# Altium schematic sheet MCU.SchDoc
size A3; SheetNumber: 2; SheetTotal: 14
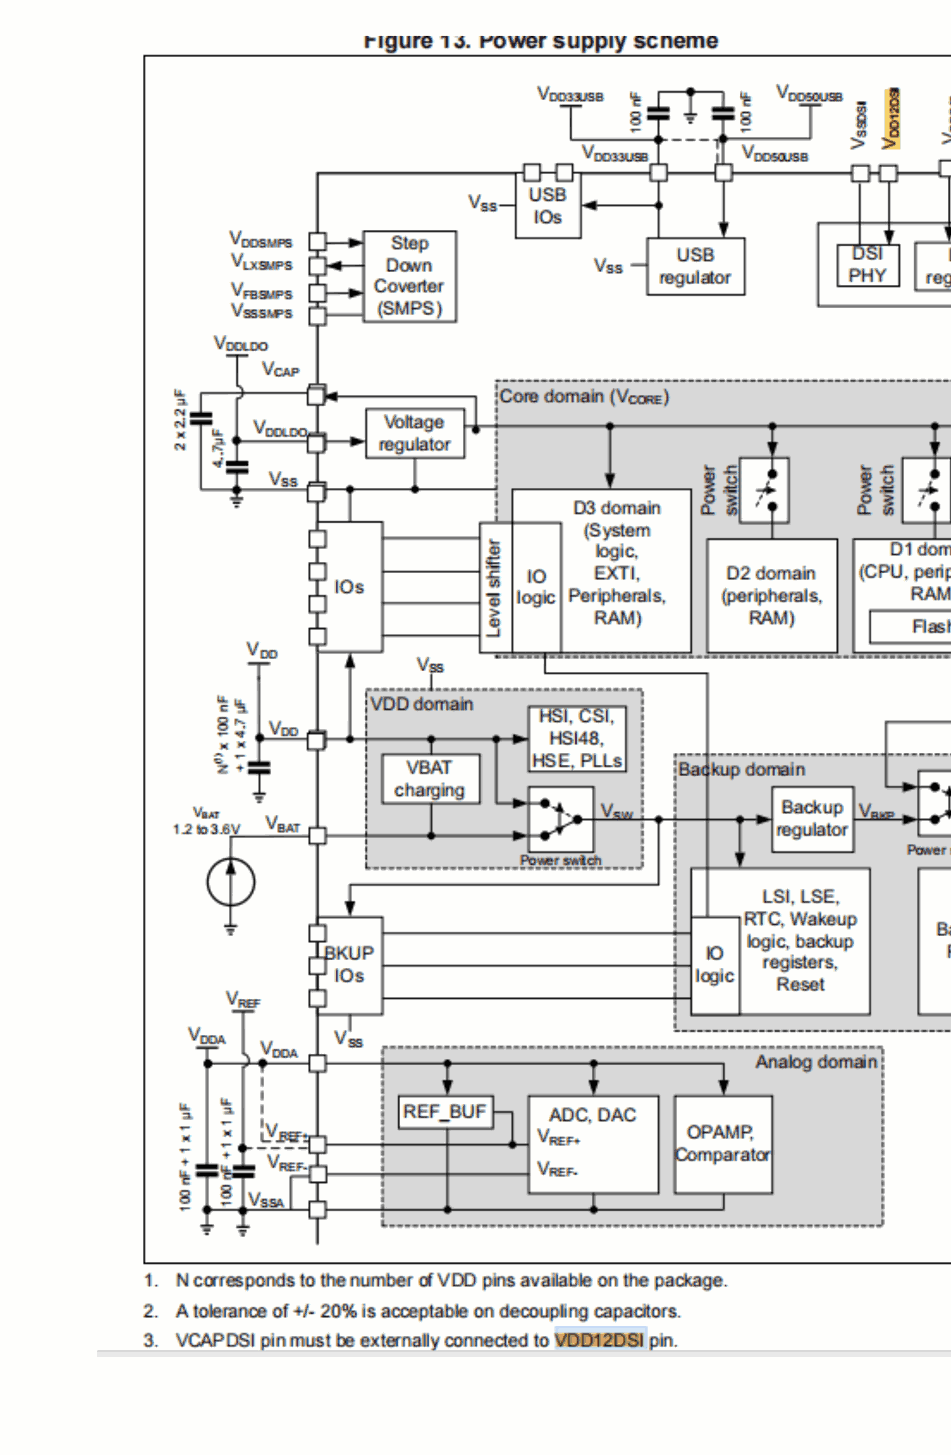
[diagram p0: MCU.SchDoc, top left]
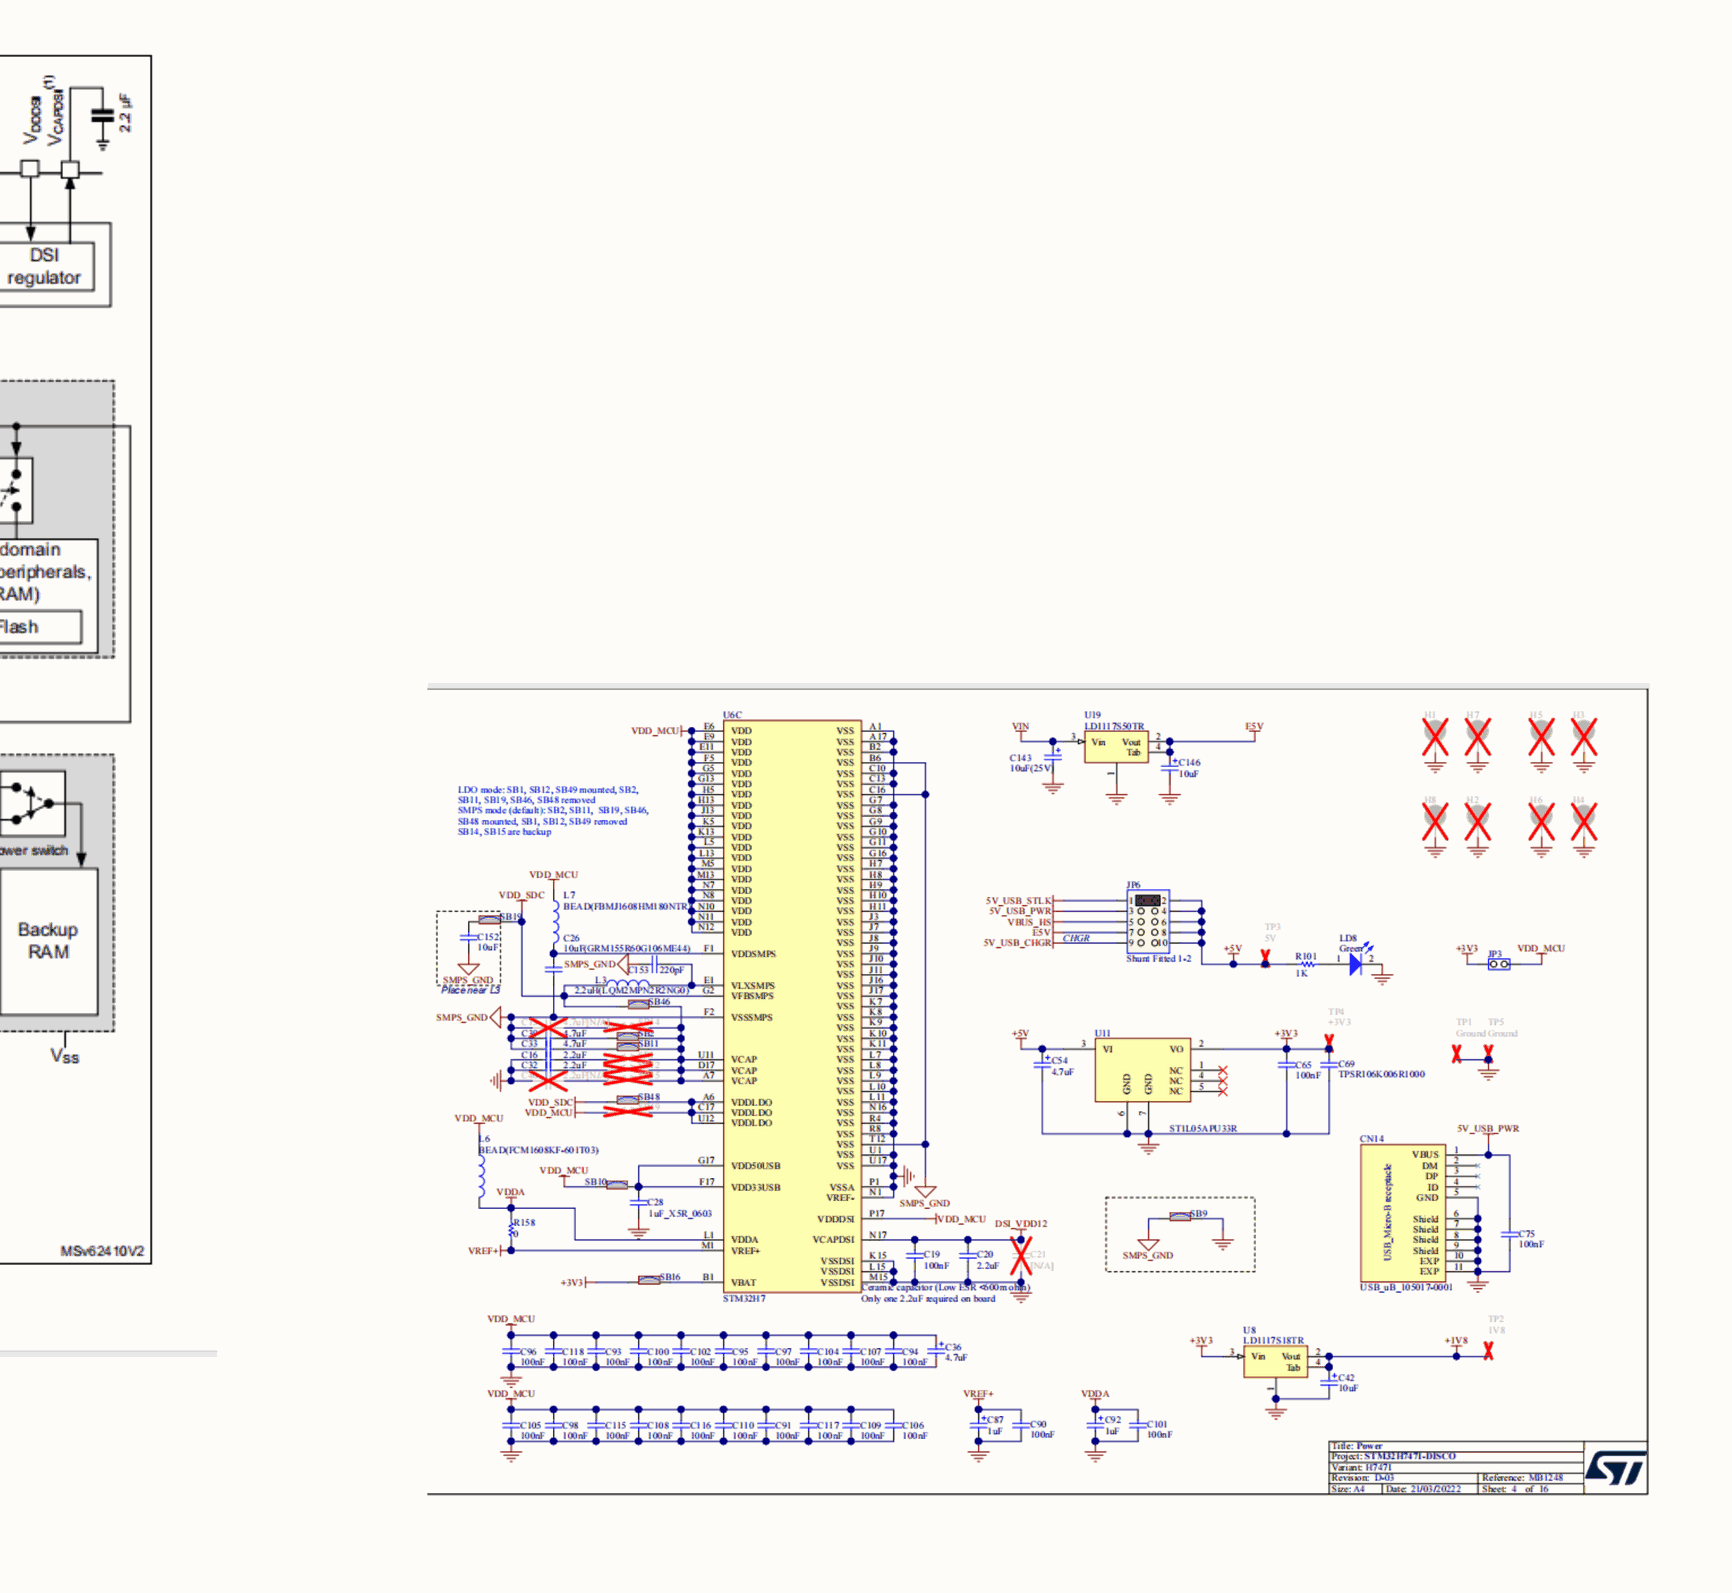
[diagram p1: MCU.SchDoc, top middle]
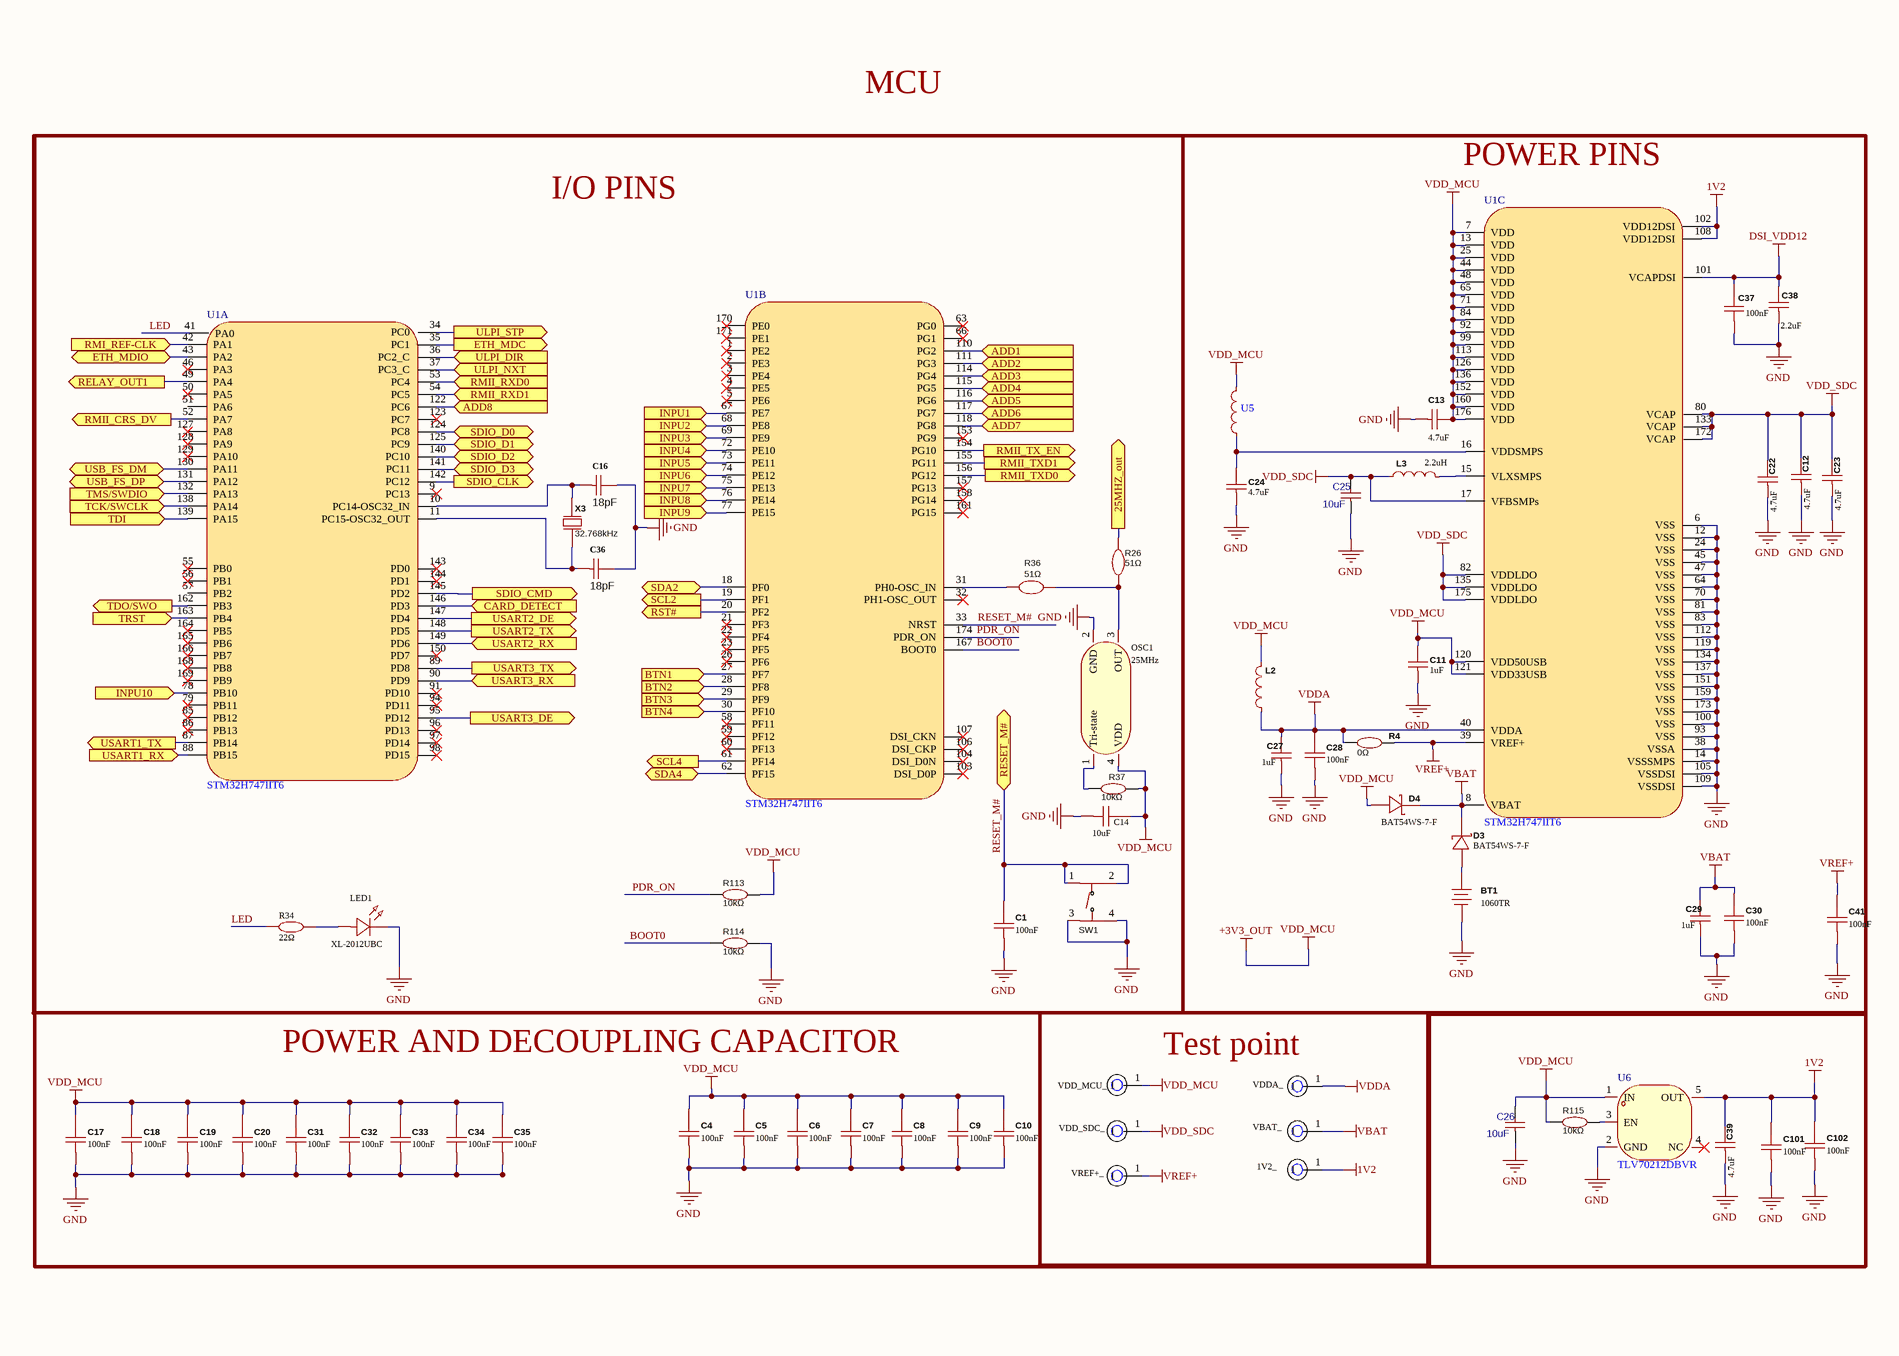
[diagram p2: MCU.SchDoc, bottom left]
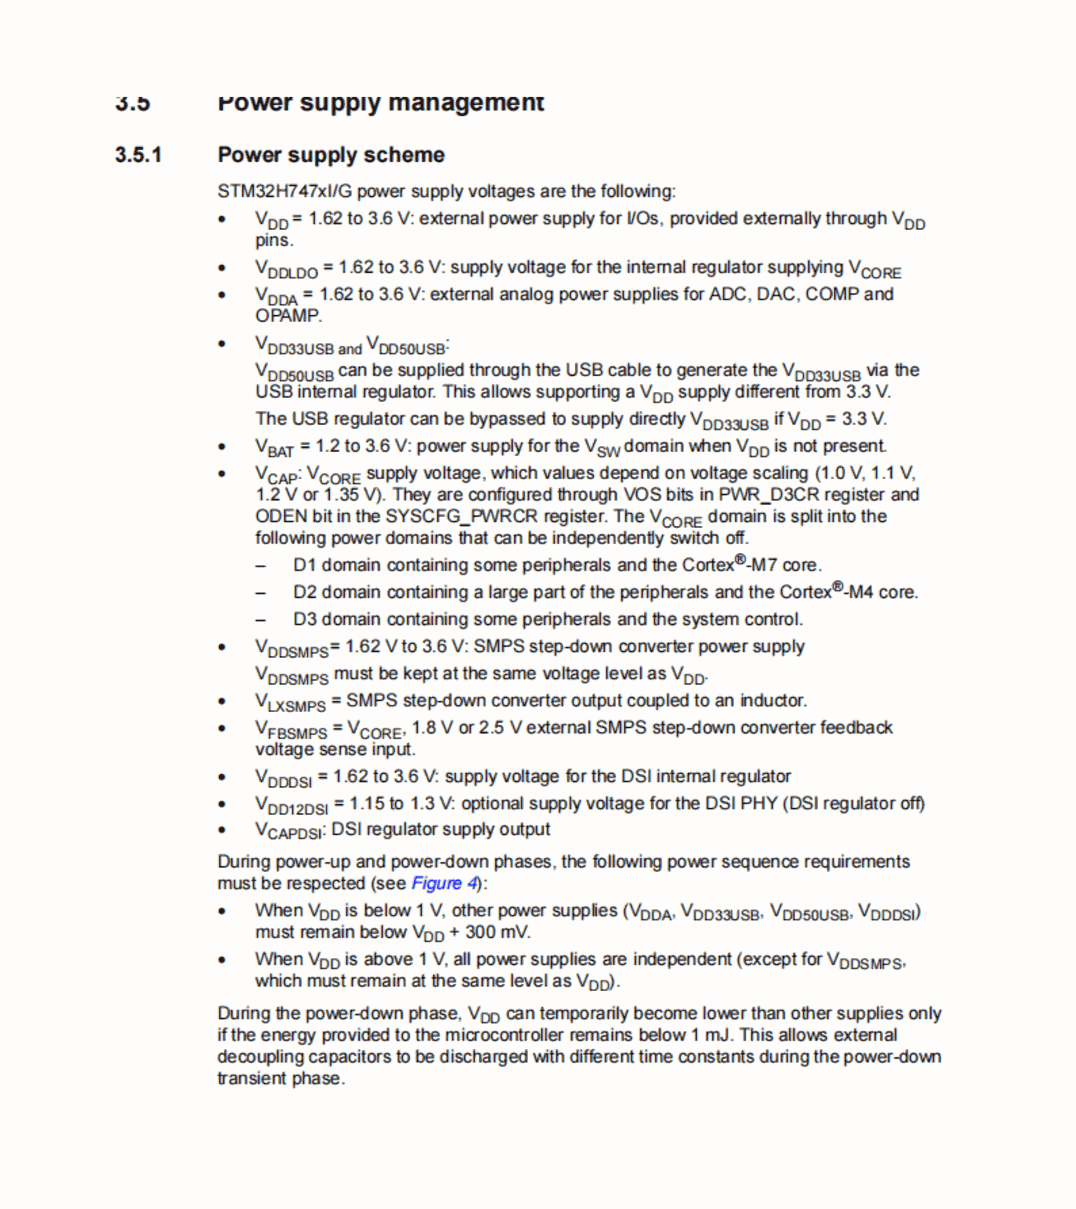
[diagram p3: MCU.SchDoc, bottom middle]
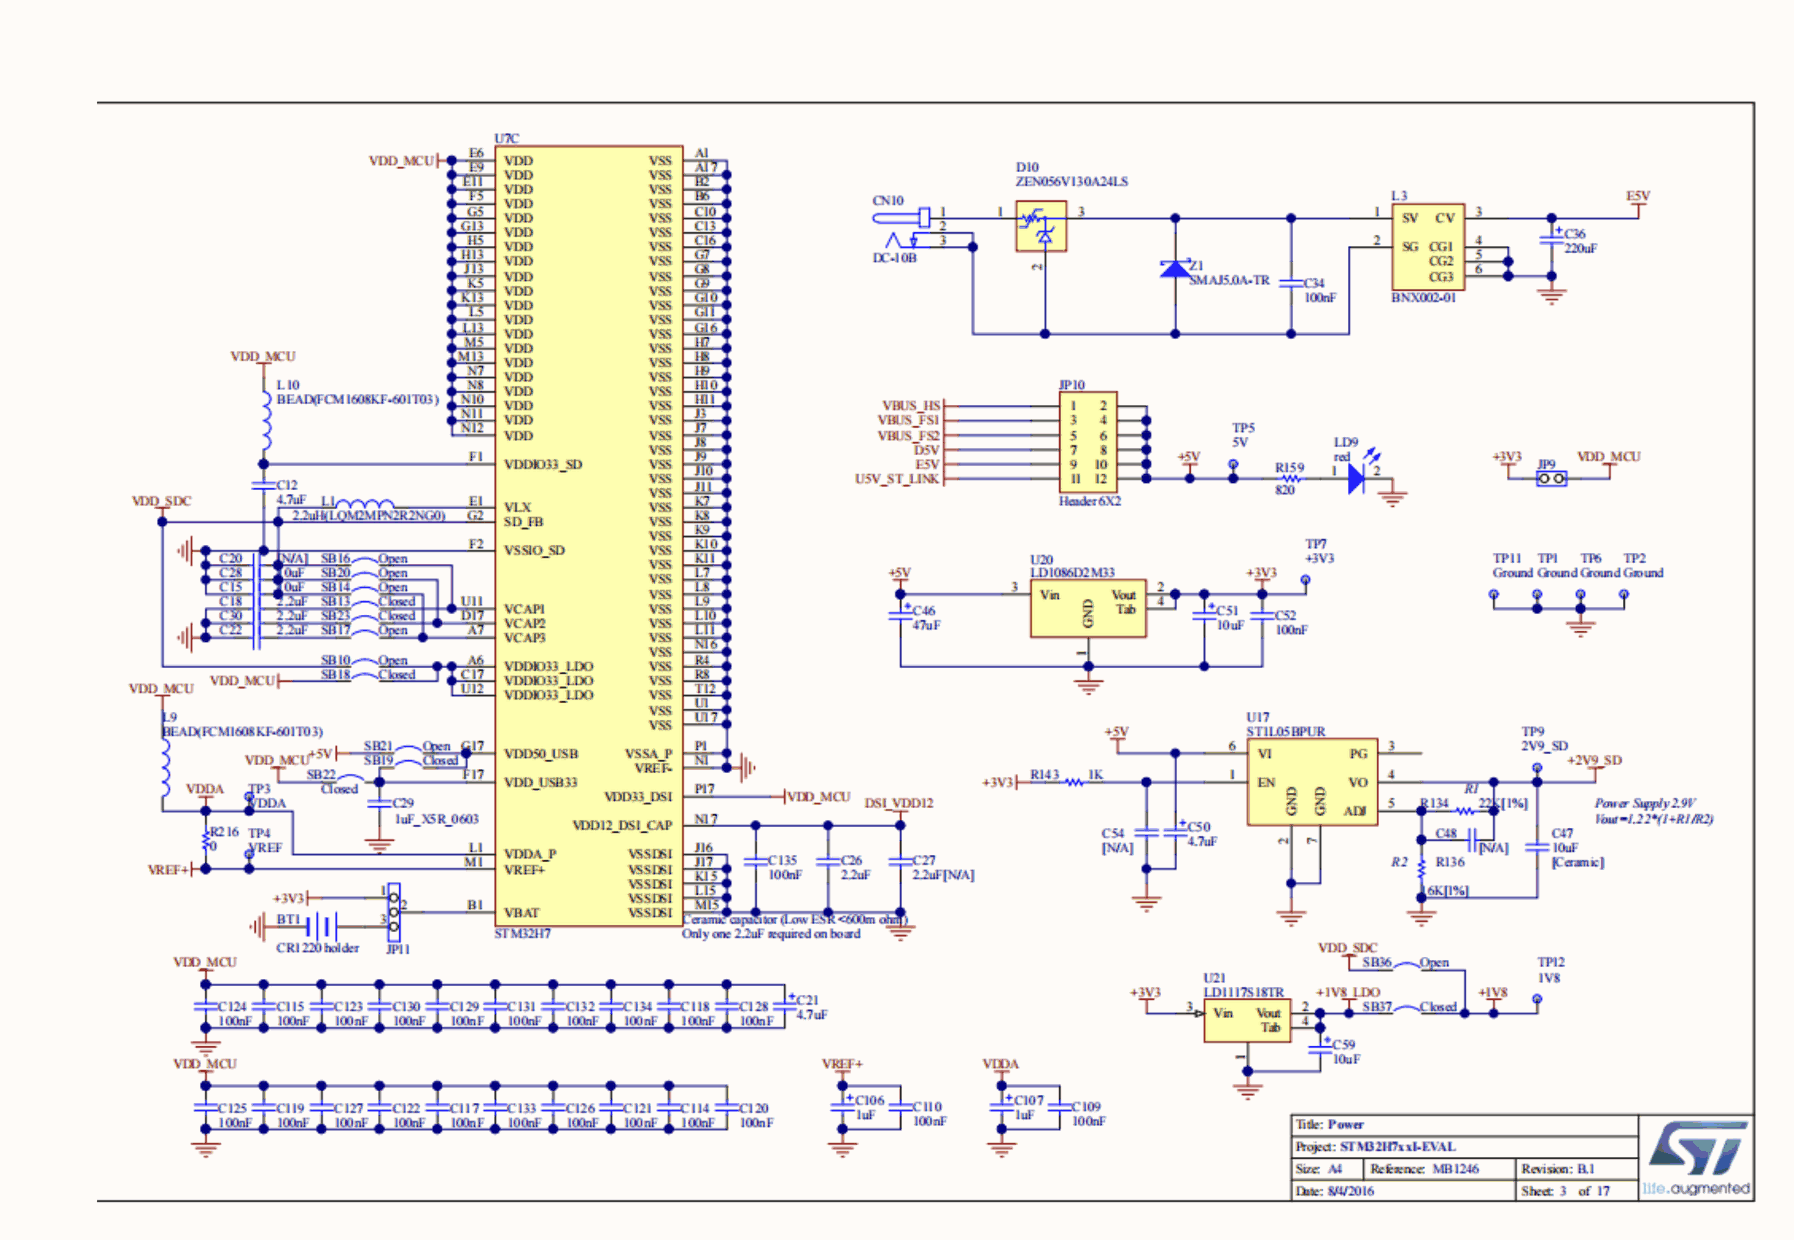
[diagram p4: MCU.SchDoc, bottom right]

## Parts
1V2_  TP  [TP]  (value not drawn)  (no BOM)
BT1  1060TR  [BAT-SMD_1060TR]
C1  100nF  [C_0603]
C4  100nF  [C_0603]
C5  100nF  [C_0603]
C6  100nF  [C_0603]
C7  100nF  [C_0603]
C8  100nF  [C_0603]
C9  100nF  [C_0603]
C10  100nF  [C_0603]
C11  1uF  [C_0805]
C12  4.7uF  [C_0805]
C13  4.7uF  [C_0805]
C14  10uF  [C_0603]
C16  18pF  [C_0603]
C17  100nF  [C_0603]
C18  100nF  [C_0603]
C19  100nF  [C_0603]
C20  100nF  [C_0603]
C22  4.7uF  [C_0805]
C23  4.7uF  [C_0805]
C24  4.7uF  [C_0805]
C25  10uF  [C_0805]
C26  10uF  [C_0805]
C27  1uF  [C_0805]
C28  100nF  [C_0603]
C29  1uF  [C_0805]
C30  100nF  [C_0603]
C31  100nF  [C_0603]
C32  100nF  [C_0603]
C33  100nF  [C_0603]
C34  100nF  [C_0603]
C35  100nF  [C_0603]
C36  18pF  [C_0603]
C37  100nF  [C_0603]
C38  2.2uF  [C_0805]
C39  4.7uF  [C_0805]
C41  100nF  [C_0603]
C101  100nF  [C_0603]
C102  100nF  [C_0603]
D3  BAT54WS-7-F  [SOD-323_L1.8-W1.3-LS2.5-RD]
D4  BAT54WS-7-F  [SOD-323_L1.8-W1.3-LS2.5-RD]
L2  FCM1608KF-601T03  [R_0603]  (value not drawn)
L3  2.2uH  [l0806]
LED1  XL-2012UBC  [LED0805-RD]
OSC1  25MHz  [OSC-SMD_4P-L2.5-W2.0-BL]
R4  0Ω  [R_0402]  (no BOM)
R26  51Ω  [R_0603]
R34  22Ω  [R_0603]
R36  51Ω  [R_0603]
R37  10kΩ  [R_0603]
R113  10kΩ  [R_0603]
R114  10kΩ  [R_0603]
R115  10kΩ  [R_0603]
SW1  TS-1187A-B-A-B  [SW-SMD_4P-L5.1-W5.1-P3.70-LS6.5-TL_H1.5]  (value not drawn)
U1  STM32H747IIT6  [LQFP-176_L24.0-W24.0-P0.50-LS26.0-BL]  (parts A,B,C of 3)
U5  ferrite_bead  [L_0603]  (value not drawn)
U6  TLV70212DBVR  [SOT-23-5_L3.0-W1.7-P0.95-LS2.8-BL]
VBAT_  TP  [TP]  (value not drawn)  (no BOM)
VDD_MCU_  TP  [TP]  (value not drawn)  (no BOM)
VDD_SDC_  TP  [TP]  (value not drawn)  (no BOM)
VDDA_  TP  [TP]  (value not drawn)  (no BOM)
VREF+_  TP  [TP]  (value not drawn)  (no BOM)
X3  32.768kHz  [OSC-SMD_2P-L3.2-W1.5]

## Blocks framed on the sheet
POWER PINS: BT1 C11-C13 C22-C25 C27-C30 C37 C38 C41 D3 D4 L2 L3 R4 U1 U5
I/O PINS: C1 C14 C16 C36 LED1 OSC1 R26 R34 R36 R37 R113 R114 SW1 U1 X3
POWER AND DECOUPLING CAPACITOR: C4-C10 C17-C20 C26 C31-C35 C39 C101 C102 R115 U6
Test point: 1V2_ VBAT_ VDD_MCU_ VDD_SDC_ VDDA_ VREF+_

## Ports
25MHZ_out (out), ADD1 (in), ADD2 (in), ADD3 (in), ADD4 (in), ADD5 (in), ADD6 (in), ADD7 (in), ADD8 (in), BTN1 (in), BTN2 (in), BTN3 (in), BTN4 (in), CARD_DETECT (in), ETH_MDC (out), ETH_MDIO (bidir), INPU1 (in), INPU2 (in), INPU3 (in), INPU4 (in), INPU5 (in), INPU6 (in), INPU7 (in), INPU8 (in), INPU9 (in), INPU10 (in), RELAY_OUT1 (out), RESET_M# (bidir), RMI_REF-CLK (in), RMII_CRS_DV (out), RMII_RXD0 (in), RMII_RXD1 (in), RMII_TX_EN (out), RMII_TXD0 (out), RMII_TXD1 (out), RST# (out), SCL2 (out), SCL4 (out), SDA2 (bidir), SDA4 (bidir), SDIO_CLK (out), SDIO_CMD (out), SDIO_D0 (bidir), SDIO_D1 (bidir), SDIO_D2 (bidir), SDIO_D3 (bidir), TCK/SWCLK (in), TDI (in), TDO/SWO (out), TMS/SWDIO (in), TRST (in), ULPI_DIR (in), ULPI_NXT (in), ULPI_STP (out), USART1_RX (in), USART1_TX (out), USART2_DE (out), USART2_RX (in), USART2_TX (out), USART3_DE (out), USART3_RX (in), USART3_TX (out), USB_FS_DM (bidir), USB_FS_DP (bidir)

## Nets
1V2: 1V2_.1 C39.2 C101.1 C102.1 U1.102(VDD12DSI) U1.108(VDD12DSI) U6.5(OUT)
+3V3_OUT: C4.1 C5.1 C6.1 C7.1 C8.1 C9.1 C10.1 C11.2 C13.2 C14.1 C17.1 C18.1 C19.1 C20.1 C26.2 C31.1 C32.1 C33.1 C34.1 C35.1 D4.2 L2.2 OSC1.4(VDD) R37.1 R113.1 R115.1 U1.7(VDD) U1.13(VDD) U1.25(VDD) U1.44(VDD) U1.48(VDD) U1.65(VDD) U1.71(VDD) U1.84(VDD) U1.92(VDD) U1.99(VDD) U1.113(VDD) U1.120(VDD50USB) U1.121(VDD33USB) U1.126(VDD) U1.136(VDD) U1.152(VDD) U1.160(VDD) U1.176(VDD) U5.2 U6.1(IN) VDD_MCU_.1  [also labelled VDD_MCU]
DSI_VDD12: C37.1 C38.2 U1.101(VCAPDSI)
GND: BT1.2(-) C1.2 C4.2 C5.2 C6.2 C7.2 C8.2 C9.2 C10.2 C11.1 C12.1 C13.1 C14.2 C16.2 C17.2 C18.2 C19.2 C20.2 C22.1 C23.1 C24.1 C25.1 C26.1 C27.1 C28.2 C29.1 C30.2 C31.2 C32.2 C33.2 C34.2 C35.2 C36.2 C37.2 C38.1 C39.1 C41.2 C101.2 C102.2 LED1.1(K) OSC1.2(GND) R114.1 SW1.3(C) SW1.4(D) U1.6(VSS) U1.12(VSS) U1.14(VSSSMPS) U1.24(VSS) U1.38(VSSA) U1.45(VSS) U1.47(VSS) U1.64(VSS) U1.70(VSS) U1.81(VSS) U1.83(VSS) U1.93(VSS) U1.100(VSS) U1.105(VSSDSI) U1.109(VSSDSI) U1.112(VSS) U1.119(VSS) U1.134(VSS) U1.137(VSS) U1.151(VSS) U1.159(VSS) U1.173(VSS) U6.2(GND)
VBAT: C29.2 C30.1 D3.1 D4.1 U1.8(VBAT) VBAT_.1
VDD_SDC: C12.2 C22.2 C23.2 C25.2 L3.1 U1.17(VFBSMPs) U1.80(VCAP) U1.82(VDDLDO) U1.133(VCAP) U1.135(VDDLDO) U1.172(VCAP) U1.175(VDDLDO) VDD_SDC_.1
VDDA: C27.2 C28.1 L2.1 R4.2 U1.40(VDDA) VDDA_.1
VREF+: C41.1 R4.1 U1.39(VREF+) VREF+_.1
25MHZ_out: R26.2 ; port 25MHZ_out
ADD1: U1.110(PG2) ; port ADD1
ADD2: U1.111(PG3) ; port ADD2
ADD3: U1.114(PG4) ; port ADD3
ADD4: U1.115(PG5) ; port ADD4
ADD5: U1.116(PG6) ; port ADD5
ADD6: U1.117(PG7) ; port ADD6
ADD7: U1.118(PG8) ; port ADD7
ADD8: U1.122(PC6) ; port ADD8
BOOT0: R114.2 U1.167(BOOT0)
BTN1: U1.27(PF7) ; port BTN1
BTN2: U1.28(PF8) ; port BTN2
BTN3: U1.29(PF9) ; port BTN3
BTN4: U1.30(PF10) ; port BTN4
CARD_DETECT: U1.146(PD3) ; port CARD_DETECT
ETH_MDC: U1.35(PC1) ; port ETH_MDC
ETH_MDIO: U1.43(PA2) ; port ETH_MDIO
INPU1: U1.67(PE7) ; port INPU1
INPU2: U1.68(PE8) ; port INPU2
INPU3: U1.69(PE9) ; port INPU3
INPU4: U1.72(PE10) ; port INPU4
INPU5: U1.73(PE11) ; port INPU5
INPU6: U1.74(PE12) ; port INPU6
INPU7: U1.75(PE13) ; port INPU7
INPU8: U1.76(PE14) ; port INPU8
INPU9: U1.77(PE15) ; port INPU9
INPU10: U1.78(PB10) ; port INPU10
LED: R34.2 U1.41(PA0)
PDR_ON: R113.2 U1.174(PDR_ON)
RELAY_OUT1: U1.49(PA4) ; port RELAY_OUT1
RESET_M#: C1.1 SW1.1(A) SW1.2(B) U1.33(NRST) ; port RESET_M#
RMI_REF-CLK: U1.42(PA1) ; port RMI_REF-CLK
RMII_CRS_DV: U1.52(PA7) ; port RMII_CRS_DV
RMII_RXD0: U1.53(PC4) ; port RMII_RXD0
RMII_RXD1: U1.54(PC5) ; port RMII_RXD1
RMII_TX_EN: U1.154(PG10) ; port RMII_TX_EN
RMII_TXD0: U1.156(PG12) ; port RMII_TXD0
RMII_TXD1: U1.155(PG11) ; port RMII_TXD1
RST#: U1.20(PF2) ; port RST#
SCL2: U1.19(PF1) ; port SCL2
SCL4: U1.61(PF14) ; port SCL4
SDA2: U1.18(PF0) ; port SDA2
SDA4: U1.62(PF15) ; port SDA4
SDIO_CLK: U1.142(PC12) ; port SDIO_CLK
SDIO_CMD: U1.145(PD2) ; port SDIO_CMD
SDIO_D0: U1.124(PC8) ; port SDIO_D0
SDIO_D1: U1.125(PC9) ; port SDIO_D1
SDIO_D2: U1.140(PC10) ; port SDIO_D2
SDIO_D3: U1.141(PC11) ; port SDIO_D3
TCK/SWCLK: U1.138(PA14) ; port TCK/SWCLK
TDI: U1.139(PA15) ; port TDI
TDO/SWO: U1.162(PB3) ; port TDO/SWO
TMS/SWDIO: U1.132(PA13) ; port TMS/SWDIO
TRST: U1.163(PB4) ; port TRST
ULPI_DIR: U1.36(PC2_C) ; port ULPI_DIR
ULPI_NXT: U1.37(PC3_C) ; port ULPI_NXT
ULPI_STP: U1.34(PC0) ; port ULPI_STP
USART1_RX: U1.88(PB15) ; port USART1_RX
USART1_TX: U1.87(PB14) ; port USART1_TX
USART2_DE: U1.147(PD4) ; port USART2_DE
USART2_RX: U1.149(PD6) ; port USART2_RX
USART2_TX: U1.148(PD5) ; port USART2_TX
USART3_DE: U1.95(PD12) ; port USART3_DE
USART3_RX: U1.90(PD9) ; port USART3_RX
USART3_TX: U1.89(PD8) ; port USART3_TX
USB_FS_DM: U1.130(PA11) ; port USB_FS_DM
USB_FS_DP: U1.131(PA12) ; port USB_FS_DP
NetBT1_1: BT1.1(+) D3.2
NetC16_1: C16.1 U1.10(PC14-OSC32_IN) X3.1(OSC1)
NetC24_2: C24.2 U1.16(VDDSMPS) U5.1
NetC36_1: C36.1 U1.11(PC15-OSC32_OUT) X3.2(OSC2)
NetL3_2: L3.2 U1.15(VLXSMPS)
NetLED1_2: LED1.2(A) R34.1
NetOSC1_1: OSC1.1(Tri-state) R37.2
NetOSC1_3: OSC1.3(OUT) R26.1 R36.2
NetR36_1: R36.1 U1.31(PH0-OSC_IN)
NetR115_2: R115.2 U6.3(EN)

Not connected (* = marked no-connect by the designer): U1 1(PE2)* 2(PE3)* 3(PE4)* 4(PE5)* 5(PE6)* 9(PC13)* 21(PF3)* 22(PF4)* 23(PF5)* 26(PF6)* 32(PH1-OSC_OUT)* 46(PA3)* 50(PA5)* 51(PA6) 55(PB0)* 56(PB1)* 57(PB2) 58(PF11)* 59(PF12)* 60(PF13)* 63(PG0)* 66(PG1)* 79(PB11)* 85(PB12)* 86(PB13)* 91(PD10)* 94(PD11)* 96(PD13)* 97(PD14)* 98(PD15)* 103(DSI_D0P)* 104(DSI_D0N)* 106(DSI_CKP)* 107(DSI_CKN)* 123(PC7)* 127(PA8)* 128(PA9)* 129(PA10)* 143(PD0)* 144(PD1)* 150(PD7)* 153(PG9)* 157(PG13)* 158(PG14)* 161(PG15)* 164(PB5)* 165(PB6)* 166(PB7)* 168(PB8)* 169(PB9)* 170(PE0)* 171(PE1)*; U6 4(NC)*

## Notes on the sheet
- MCU
- Project Name:
- Size:
- Date:
- A3
- Version:
- Time:
- V1.4.0.0
- Sheet:
- Of
- File:

## Library data of the parts
BT1 = 1060TR: Manufacturer: Keystone; Add into BOM: yes; Symbol: 1060TR; Device: 1060TR; LCSC Part Name: 1060TR; Supplier Part: C238069; Manufacturer Part: 1060TR; Supplier Footprint: SMD; JLCPCB Part Class: Extended Part; Datasheet: https://atta.szlcsc.com/upload/public/pdf/source/20230320/C1BE6CFA374F9ACD78161F1E1BA128C8.pdf; Supplier: LCSC; Convert to PCB: yes
C1 C4-C10 C17-C20 C28 C30-C35 C37 C41 C101 C102 = CC0603KRX7R9BB104: Manufacturer: YAGEO(国巨); Add into BOM: yes; Tolerance: ±10%; Voltage Rating: 50V; Temperature Coefficient: X7R; Symbol: CC0603KRX7R9BB104; Device: CC0603KRX7R9BB104; LCSC Part Name: 100nF ±10% 50V; Supplier Part: C14663; Manufacturer Part: CC0603KRX7R9BB104; Supplier Footprint: 0603; JLCPCB Part Class: Basic Part; Datasheet: https://item.szlcsc.com/datasheet/CC0603KRX7R9BB104/15331.html; Supplier: LCSC; Convert to PCB: yes; Value: 100nF
C11 C27 C29 = CL21B105KBFNNNE: Manufacturer: SAMSUNG(三星); Add into BOM: yes; Tolerance: ±10%; Voltage Rating: 50V; Temperature Coefficient: X7R; Symbol: CL21B105KBFNNNE; Device: CL21B105KBFNNNE; Supplier: LCSC; Manufacturer Part: CL21B105KBFNNNE; Value: 1uF; Supplier Part: C28323; JLCPCB Part Class: Basic Part; LCSC Part Name: 1uF ±10% 50V; Supplier Footprint: 0805; Datasheet: https://item.szlcsc.com/datasheet/CL21B105KBFNNNE/29074.html; Convert to PCB: yes
C12 C13 C22-C24 C39 = CL21A475KBQNNNE: Manufacturer: SAMSUNG(三星); Add into BOM: yes; Tolerance: ±10%; Voltage Rating: 50V; Temperature Coefficient: X5R; Symbol: CL21A475KBQNNNE; Device: CL21A475KBQNNNE; LCSC Part Name: 4.7uF ±10% 50V; Supplier Part: C98192; Manufacturer Part: CL21A475KBQNNNE; Supplier Footprint: 0805; JLCPCB Part Class: Extended Part; Datasheet: https://item.szlcsc.com/datasheet/CL21A475KBQNNNE/99401.html; Supplier: LCSC; Convert to PCB: yes; Value: 4.7uF
C14 = CL10A106KP8NNNC: Manufacturer: SAMSUNG(三星); Add into BOM: yes; Tolerance: ±10%; Voltage Rating: 10V; Temperature Coefficient: X5R; Symbol: CL10A106KP8NNNC; Device: CL10A106KP8NNNC; LCSC Part Name: 10uF ±10% 10V; Supplier Part: C19702; Manufacturer Part: CL10A106KP8NNNC; Supplier Footprint: 0603; JLCPCB Part Class: Basic Part; Datasheet: https://item.szlcsc.com/datasheet/CL10A106KP8NNNC/20411.html; Supplier: LCSC; Convert to PCB: yes; Value: 10uF
C16 C36 = CL10C180JB8NNNC: Manufacturer: SAMSUNG(三星); Add into BOM: yes; Tolerance: ±5%; Voltage Rating: 50V; Temperature Coefficient: C0G; Symbol: CL10C180JB8NNNC; Device: CL10C180JB8NNNC; LCSC Part Name: 18pF ±5% 50V; Supplier Part: C1647; Manufacturer Part: CL10C180JB8NNNC; Supplier Footprint: 0603; JLCPCB Part Class: Basic Part; Datasheet: https://item.szlcsc.com/datasheet/CL10C180JB8NNNC/1999.html; Supplier: LCSC; Convert to PCB: yes; Value: 18pF
C25 C26 = 10uF: Manufacturer Part: CL21A106KOQNNNE; Manufacturer: SAMSUNG(三星); nameAlias: Value; Supplier: LCSC; Supplier Part: C1713; JLCPCB Part Class: Extended Part; spicePre: C; spiceSymbolName: CL21A106KOQNNNE
C38 = CL21B225KAFNNNE: Manufacturer: SAMSUNG(三星); Add into BOM: yes; Tolerance: ±10%; Voltage Rating: 25V; Temperature Coefficient: X7R; Symbol: CL21B225KAFNNNE; Device: CL21B225KAFNNNE; LCSC Part Name: 2.2uF ±10% 25V; Supplier Part: C19110; Manufacturer Part: CL21B225KAFNNNE; Supplier Footprint: 0805; JLCPCB Part Class: Extended Part; Datasheet: https://item.szlcsc.com/datasheet/CL21B225KAFNNNE/19814.html; Supplier: LCSC; Convert to PCB: yes; Value: 2.2uF
D3 D4 = BAT54WS-7-F: Manufacturer: DIODES(美台); Add into BOM: yes; Voltage - Forward(Vf@If): 1V@100mA; Voltage - DC Reverse(Vr): 30V; Current - Rectified: 100mA; Reverse Leakage Current (Ir): 2uA@25V; Non-Repetitive Peak Forward Surge Current: 600mA; Symbol: BAT54WS-7-F; Device: BAT54WS-7-F; Supplier: LCSC; Manufacturer Part: BAT54WS-7-F; Supplier Part: C124205; JLCPCB Part Class: Extended Part; LCSC Part Name: 电压:30V 电流:100mA; Supplier Footprint: SOD-323; Datasheet: https://item.szlcsc.com/datasheet/BAT54WS-7-F/125480.html; Convert to PCB: yes
L2 = FCM1608KF-601T03: Manufacturer: TAI-TECH(台庆); Add into BOM: yes; Impedance @ Frequency: 600Ω@100MHz; Tolerance: ±25%; DC Resistance(DCR): 500mΩ; Current Rating: 350mA; Number of Circuits: 1; Symbol: FCM1608KF-601T03; Device: FCM1608KF-601T03; LCSC Part Name: 单路 0603磁珠 阻抗600Ω@100MHz; Supplier Part: C141723; Manufacturer Part: FCM1608KF-601T03; Supplier Footprint: 0603; JLCPCB Part Class: Extended Part; Datasheet: https://item.szlcsc.com/datasheet/FCM1608KF-601T03/153054.html; Supplier: LCSC; Convert to PCB: yes
L3 = LQM2MPN2R2NG0L: Manufacturer: muRata(村田); Add into BOM: yes; Tolerance: ±30%; Symbol: LQM2MPN2R2NG0L; Device: LQM2MPN2R2NG0L; Supplier: LCSC; Manufacturer Part: LQM2MPN2R2NG0L; Value: 2.2uH; Supplier Part: C83998; JLCPCB Part Class: Extended Part; LCSC Part Name: 2.2uH ±30%; Supplier Footprint: 0806; Datasheet: https://atta.szlcsc.com/upload/public/pdf/source/20170325/1490427881182.pdf; Convert to PCB: yes; Saturation Current (Isat): -; Q @ Freq: -
LED1 = XL-2012UBC: Manufacturer: XINGLIGHT(成兴光); Add into BOM: yes; Illumination Color: Blue; Voltage - Forward(Vf): 3.2V; Power(Watts): 70mW; Forward Current: 20mA; Wavelength - Dominant: 460nm~475nm; Peak Wavelength: 470nm; Lens Color: Water Clear; Luminous Intensity: 260mcd; Viewing Angle: 120°; Symbol: XL-2012UBC; Device: XL-2012UBC; LCSC Part Name: XL-2012UBC; Supplier Part: C965817; Manufacturer Part: XL-2012UBC; Supplier Footprint: 0805; JLCPCB Part Class: Extended Part; Datasheet: https://item.szlcsc.com/datasheet/XL-2012UBC/1051426.html; Supplier: LCSC; Convert to PCB: yes; Lamp Holder Type: -; Diode Configuration: -; Color Temperature: -; Mounting Style: op View Mount; Operating Temperature: -
OSC1 = OT3EL89CJI-111YLC-25M: Manufacturer: YXC(扬兴晶振); Add into BOM: yes; Normal temperature Frequency Tolerance: ±10ppm; Output Type: CMOS; Voltage - Supply: 1.8V~3.3V; Frequency Stability: ±20ppm; Symbol: OT3EL89CJI-111YLC-25M; Device: OT3EL89CJI-111YLC-25M; LCSC Part Name: YSO110TR 25MHZ 4P 2520 1.8V-3.3V ±10PPM -40~85℃（±20PPM) CMOS; Supplier Part: C7471623; Manufacturer Part: OT3EL89CJI-111YLC-25M; Supplier Footprint: SMD2520-4P; JLCPCB Part Class: Extended Part; Datasheet: https://item.szlcsc.com/datasheet/OT3EL89CJI-111YLC-25M/8526919.html; Supplier: LCSC; Convert to PCB: yes; Value: 25MHz; Operating Temperature: -40℃~+85℃
R4 = 0Ω: Manufacturer: YAGEO(国巨); Manufacturer Part: RC0402FR-070RL; nameAlias: Value; Supplier: LCSC; Supplier Part: C106231; JLCPCB Part Class: Extended Part; spicePre: R; spiceSymbolName: RC0402FR-070RL
R26 R36 = 51Ω: Manufacturer: FOJAN(富捷); Manufacturer Part: FRC0603J510 TS; nameAlias: Value; Contributor: lcsc; Supplier: LCSC; Supplier Part: C2907181; JLCPCB Part Class: Extended Part; spicePre: R; spiceSymbolName: FRC0603J510 TS
R34 = RC0603FR-0722RL: Manufacturer: YAGEO(国巨); Add into BOM: yes; Tolerance: ±1%; Temperature Coefficient: ±100ppm/℃; Symbol: RC0603FR-0722RL; Device: RC0603FR-0722RL; LCSC Part Name: 厚膜电阻 22Ω ±1% 100mW; Supplier Part: C107701; Manufacturer Part: RC0603FR-0722RL; Supplier Footprint: 0603; JLCPCB Part Class: Extended Part; Datasheet: https://atta.szlcsc.com/upload/public/pdf/source/20170914/C127450_1505359406912967677.pdf; Supplier: LCSC; Convert to PCB: yes; Type: Thick Film Resistors; Value: 22Ω; Operating Temperature Range: -55℃~+155℃
R37 R113-R115 = 10kΩ: Manufacturer: YAGEO(国巨); Manufacturer Part: RC0603FR-0710KL; nameAlias: Value; Supplier: LCSC; Supplier Part: C98220; JLCPCB Part Class: Extended Part; spicePre: R; spiceSymbolName: RC0603FR-0710KL
SW1 = TS-1187A-B-A-B: Manufacturer: XKB Connection(中国星坤); Add into BOM: yes; Circuit: SPST; Actuator Style: Round Button; Operating Force: 1.6N; Switch Height: 1.5mm; with Bracket: Without Bracket; Contact Current: 50mA; Voltage Rating: 12V; Actuator/Cap Color: Gold; With Lamp: No; Life: 100,000 Cycles; Symbol: TS-1187A-B-A-B; Device: TS-1187A-B-A-B; LCSC Part Name: 5.1*5.1*1.5mm 立贴 轻触开关; Supplier Part: C318884; Manufacturer Part: TS-1187A-B-A-B; Supplier Footprint: SMD; JLCPCB Part Class: Basic Part; Datasheet: https://item.szlcsc.com/datasheet/TS-1187A-B-A-B/299976.html; Supplier: LCSC; Convert to PCB: yes; Mounting Type: Surface Mount,Vertical; Length: 5.1mm; Width: 5.1mm; Operating Temperature: -30℃~+85℃
U1 = STM32H747IIT6: Manufacturer: ST(意法半导体); Add into BOM: yes; CPU Core: ARM other series; CPU Maximum Speed: 240MHz；480MHz; Program Storage Size: 2MB; Program Memory Type: FLASH; Number of I/O: 168; ADC (Bit): 16bit; DAC (Bit): 12bit; Low Voltage Detection Threshold: 1.62V~3.6V; Symbol: STM32H747IIT6; Device: STM32H747IIT6; LCSC Part Name: 带DSP和DP-FPU的高性能ARM Cortex-M7 + Cortex-M4 MCU，具有2 MB Flash、1 MB RAM、480 MHz CPU、ART加速器、一级缓存、外部存储器接口、大量外设、SMPS和MIPI-DSI; Supplier Part: C730199; Manufacturer Part: STM32H747IIT6; Supplier Footprint: LQFP-176(24x24); JLCPCB Part Class: Extended Part; Datasheet: https://atta.szlcsc.com/upload/public/pdf/source/20200902/C730194_AB31659919554024C167BACD3EB6D7B7.pdf; Supplier: LCSC; Convert to PCB: yes; Application Area: -
U5 = BLM18PG121SN1D: Manufacturer: muRata(村田); Symbol: BLM18PG121SN1D_C14709; Add into BOM: yes; Impedance @ Frequency: 120Ω@100MHz; Tolerance: ±25%; DC Resistance: 50mΩ; Current Rating: 2A; Circuits: 1; Device: BLM18PG121SN1D; Supplier Part: C14709; Manufacturer Part: BLM18PG121SN1D; Supplier Footprint: 0603; JLCPCB Part Class: Extended Part; Datasheet: https://atta.szlcsc.com/upload/public/pdf/source/20130704/1457706621134.pdf; Supplier: LCSC; Convert to PCB: yes
U6 = TLV70212DBVR: Manufacturer: TI(德州仪器); Add into BOM: yes; Output Type: Fixed; Maximum Input Voltage: 5.5V; Output Voltage: 1.2V; Output Current: 300mA; Power Supply Rejection Ratio (PSRR): 68dB@(1kHz); Dropout Voltage: 380mV@(300mA); standby current: 55uA; Output Polarity: Positive electrode; Number of Outputs: 1; Symbol: TLV70212DBVR; Device: TLV70212DBVR; LCSC Part Name: 具有使能功能的 300mA、高 PSRR、低 IQ、低压降稳压器; Supplier Part: C81462; Manufacturer Part: TLV70212DBVR; Supplier Footprint: SOT-23-5; JLCPCB Part Class: Extended Part; Datasheet: https://www.ti.com/cn/lit/gpn/tlv702; Supplier: LCSC; Convert to PCB: yes; Feature: ESD Protection；Low ESR；Thermal Protection(TSD)；Under-voltage Lockout；Overcurrent Protection(OCP)；With ability; Operating Temperature: -40℃~+125℃@(Tj)
X3 = ABS07-32.768KHZ-T: Manufacturer: ABRACON; Add into BOM: yes; Normal temperature Frequency Tolerance: ±20ppm; Load Capacitance: 12.5pF; Equivalent Series Resistance(ESR): 70kΩ; Symbol: ABS07-32.768KHZ-T; Device: ABS07-32.768KHZ-T; Supplier: LCSC; Supplier Part: C130253; Manufacturer Part: ABS07-32.768KHZ-T; Value: 32.768kHz; JLCPCB Part Class: Extended Part; LCSC Part Name: 32.768kHz ±20ppm 12.5pF; Supplier Footprint: SMD3215-2P; Datasheet: https://item.szlcsc.com/datasheet/ABS07-32.768KHZ-T/141540.html; Convert to PCB: yes; Type: Crystal Oscillator; Frequency Stability: -; Operating Temperature: -40℃~+85℃